# Altium schematic sheet 0110_AUDIO CODEC.SchDoc
size 848 x 558 mm
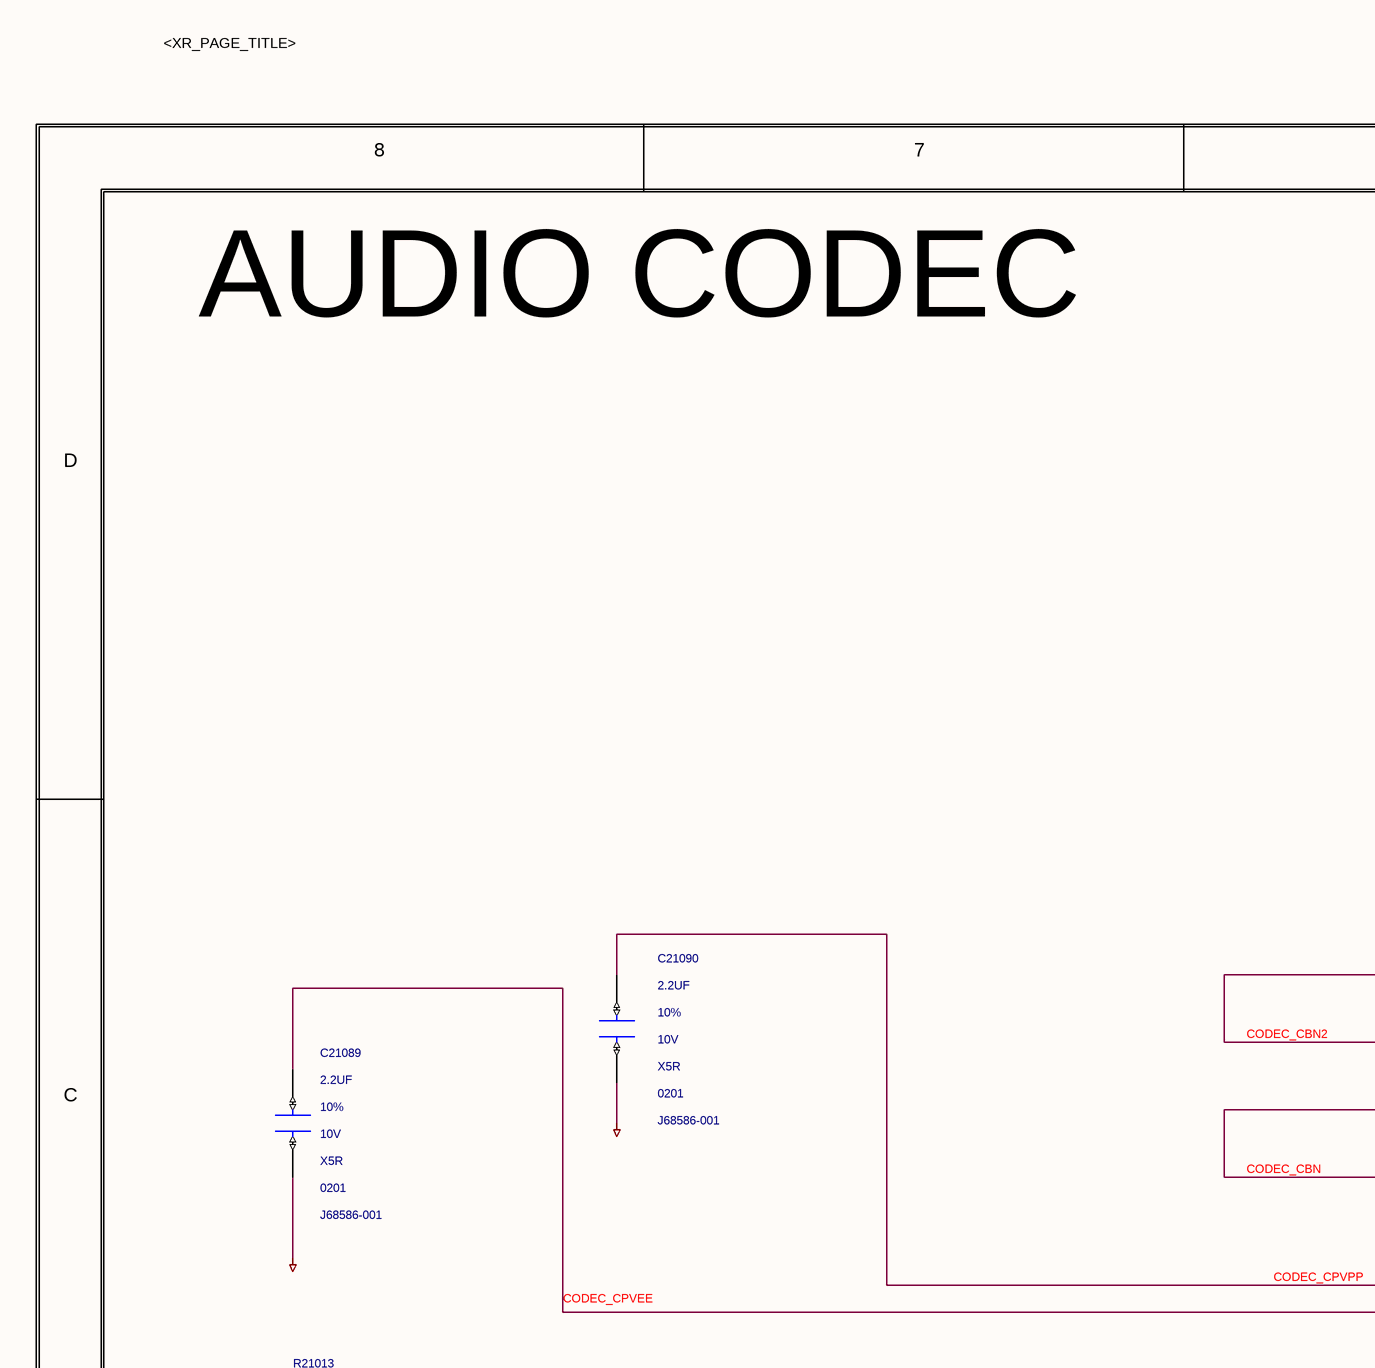
[diagram p0: 0110_AUDIO CODEC.SchDoc, top left]
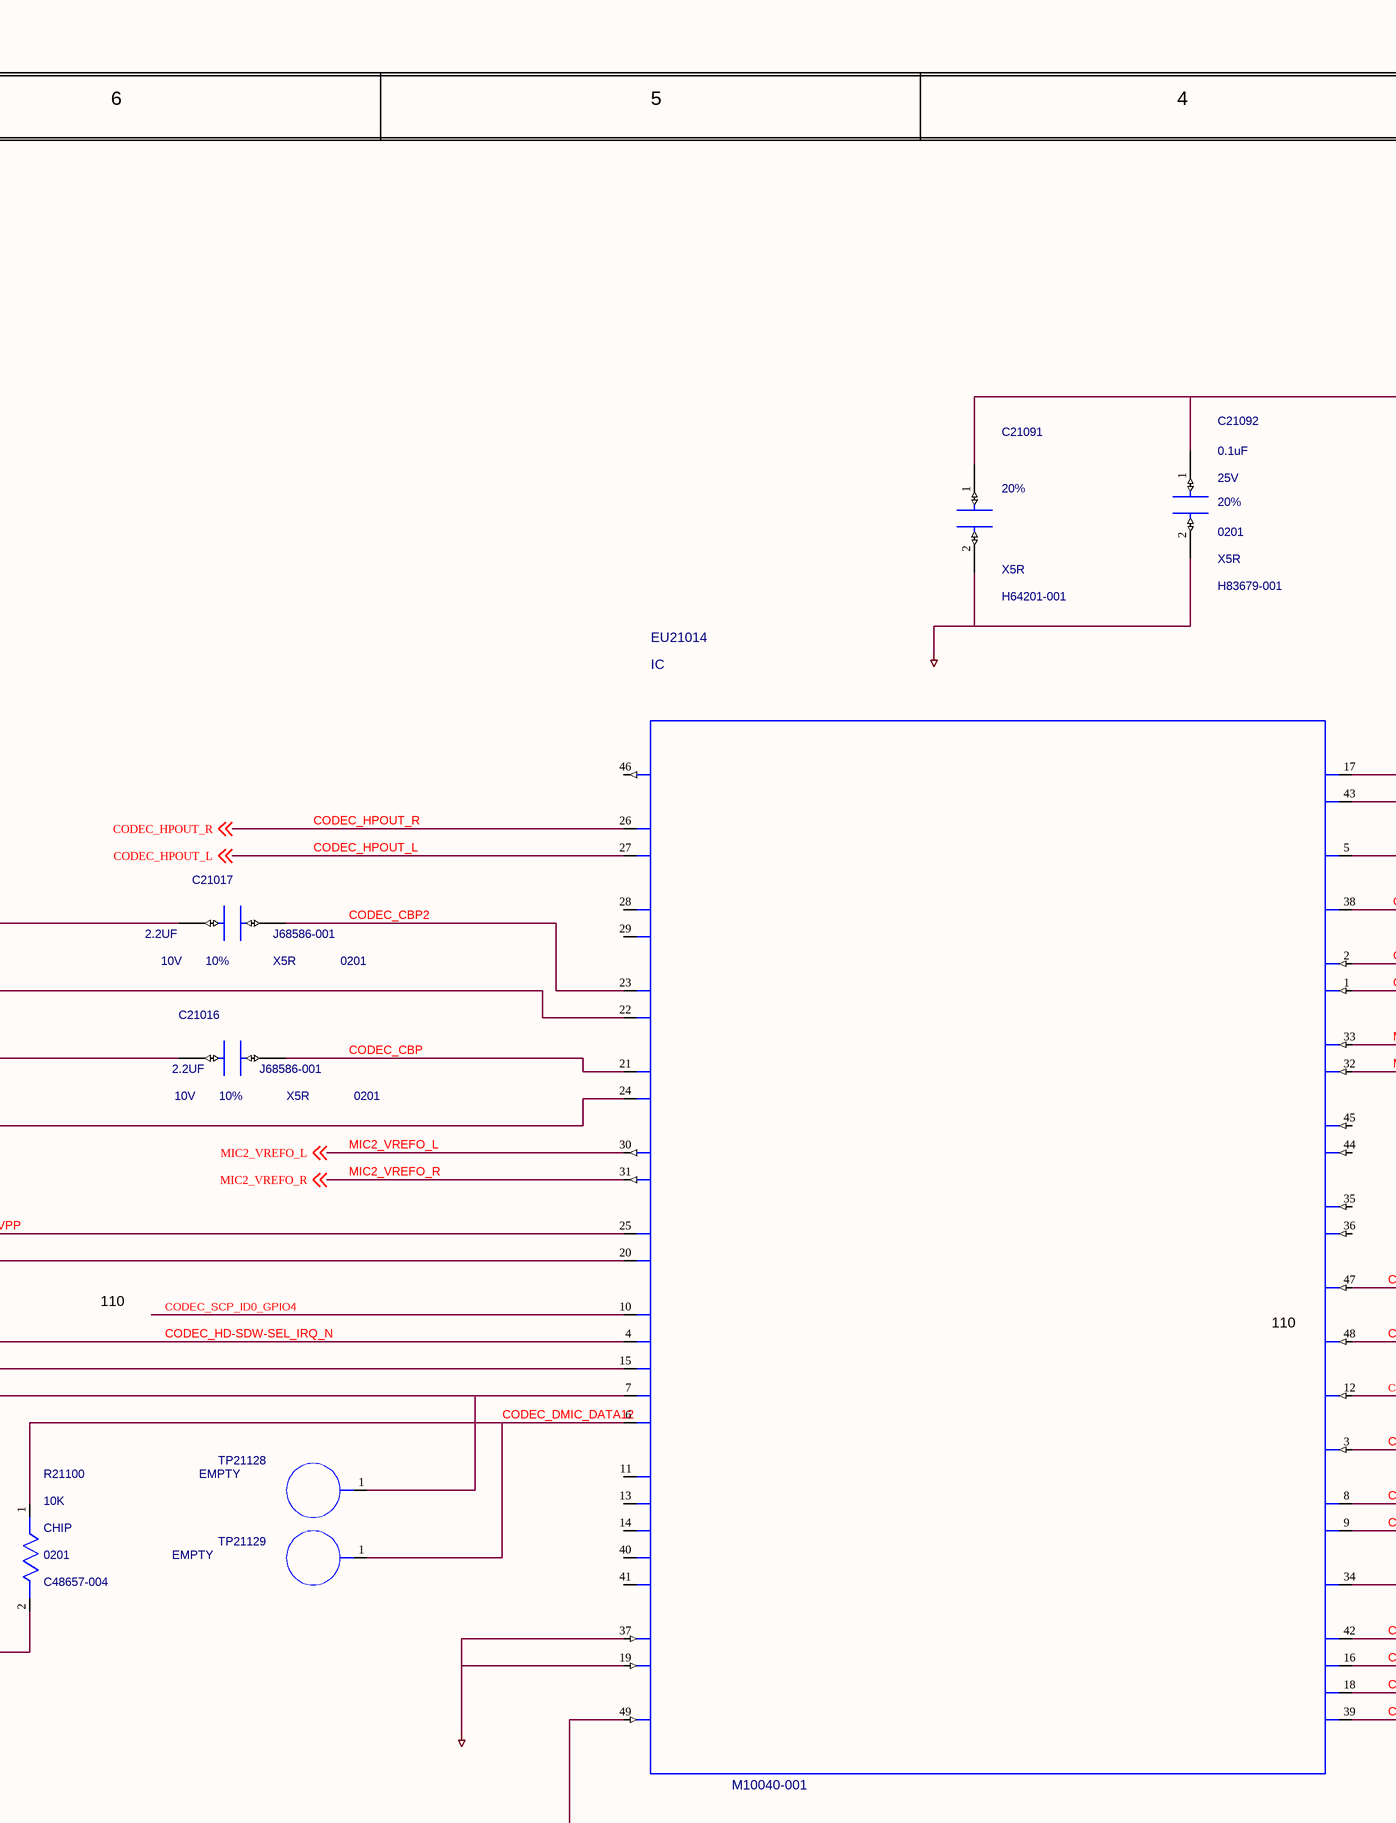
[diagram p1: 0110_AUDIO CODEC.SchDoc, top middle]
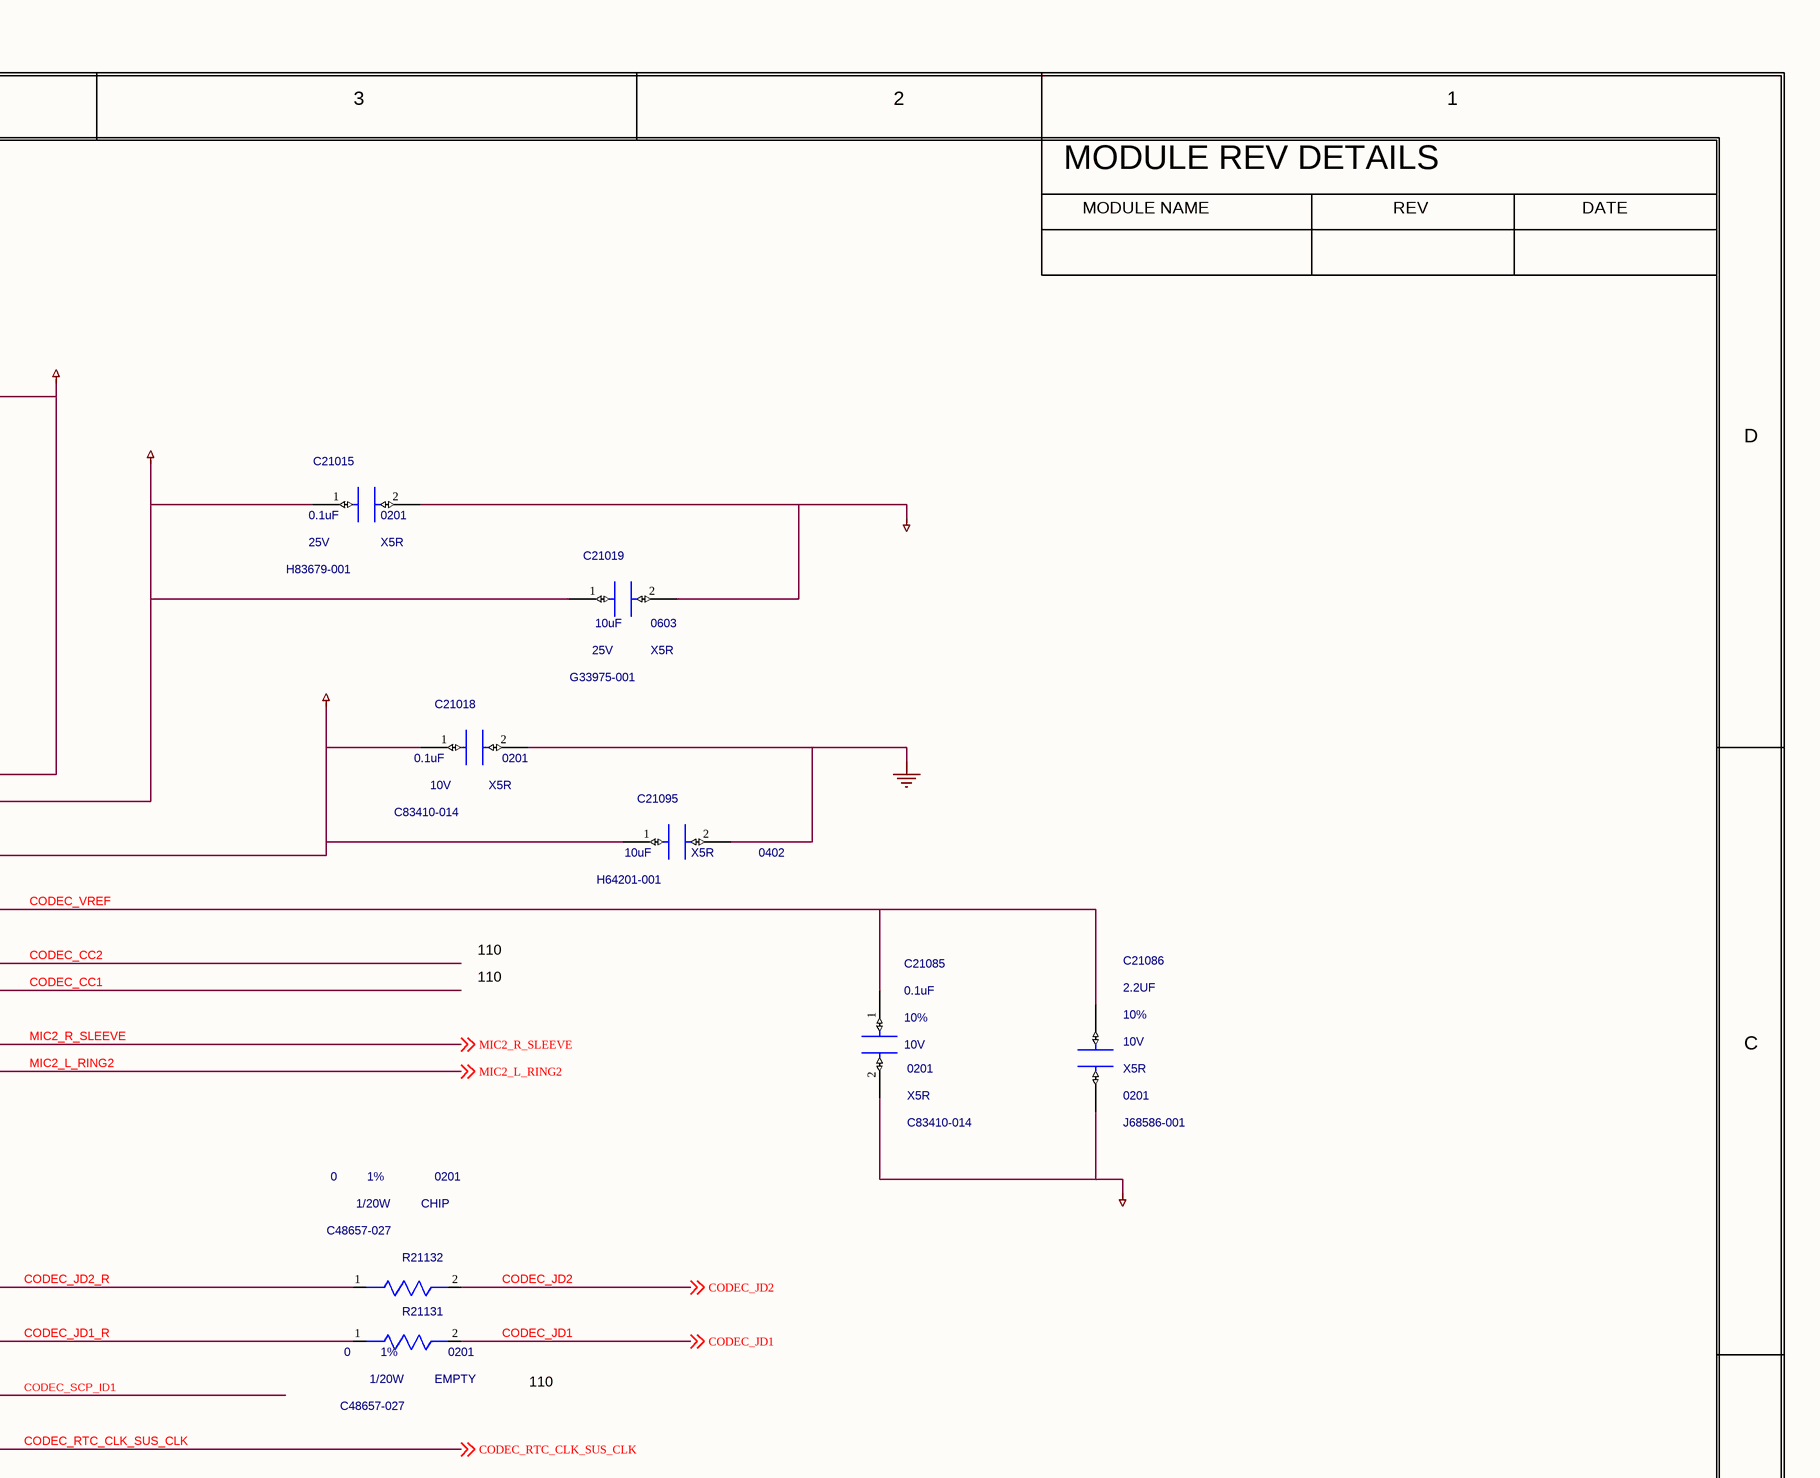
[diagram p2: 0110_AUDIO CODEC.SchDoc, top right]
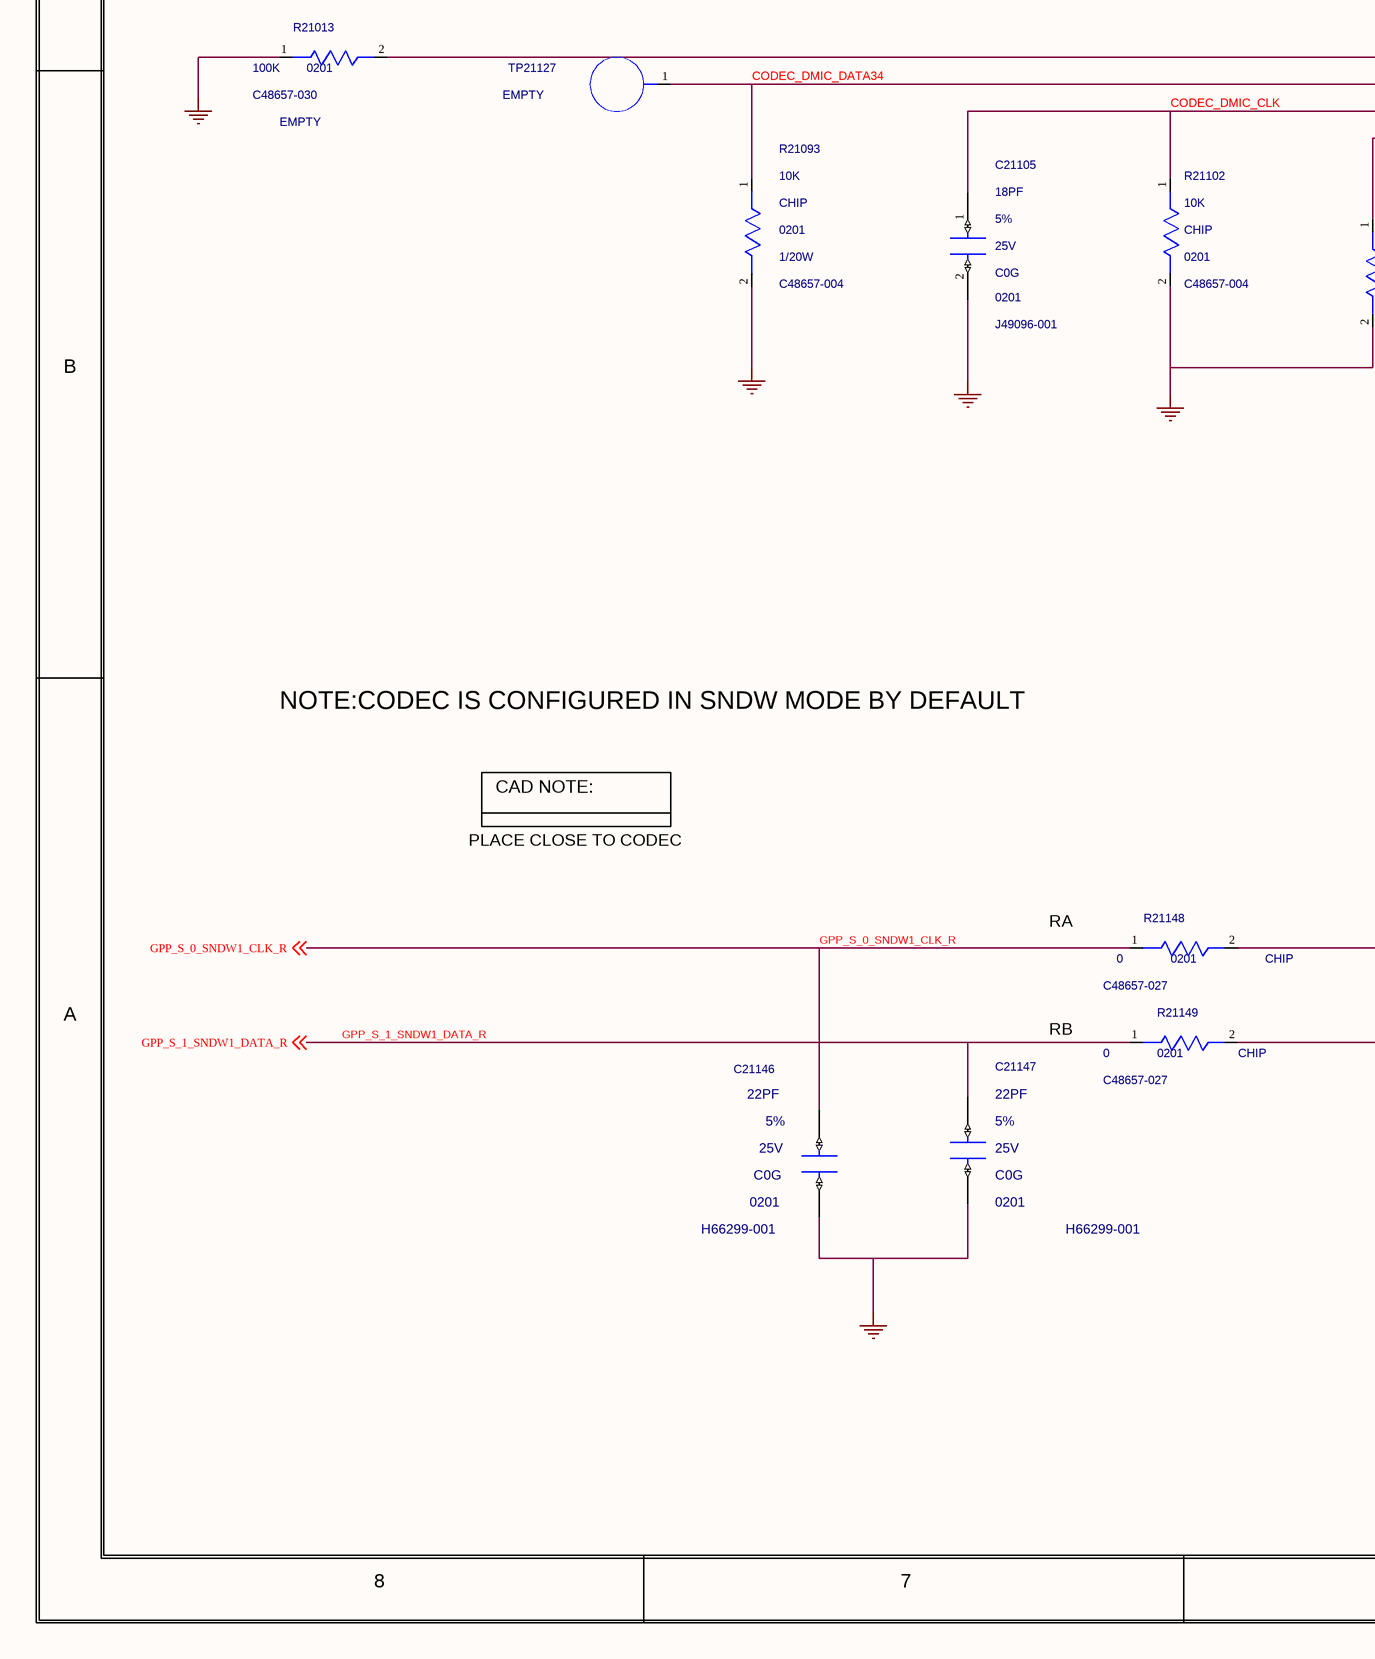
[diagram p3: 0110_AUDIO CODEC.SchDoc, bottom left]
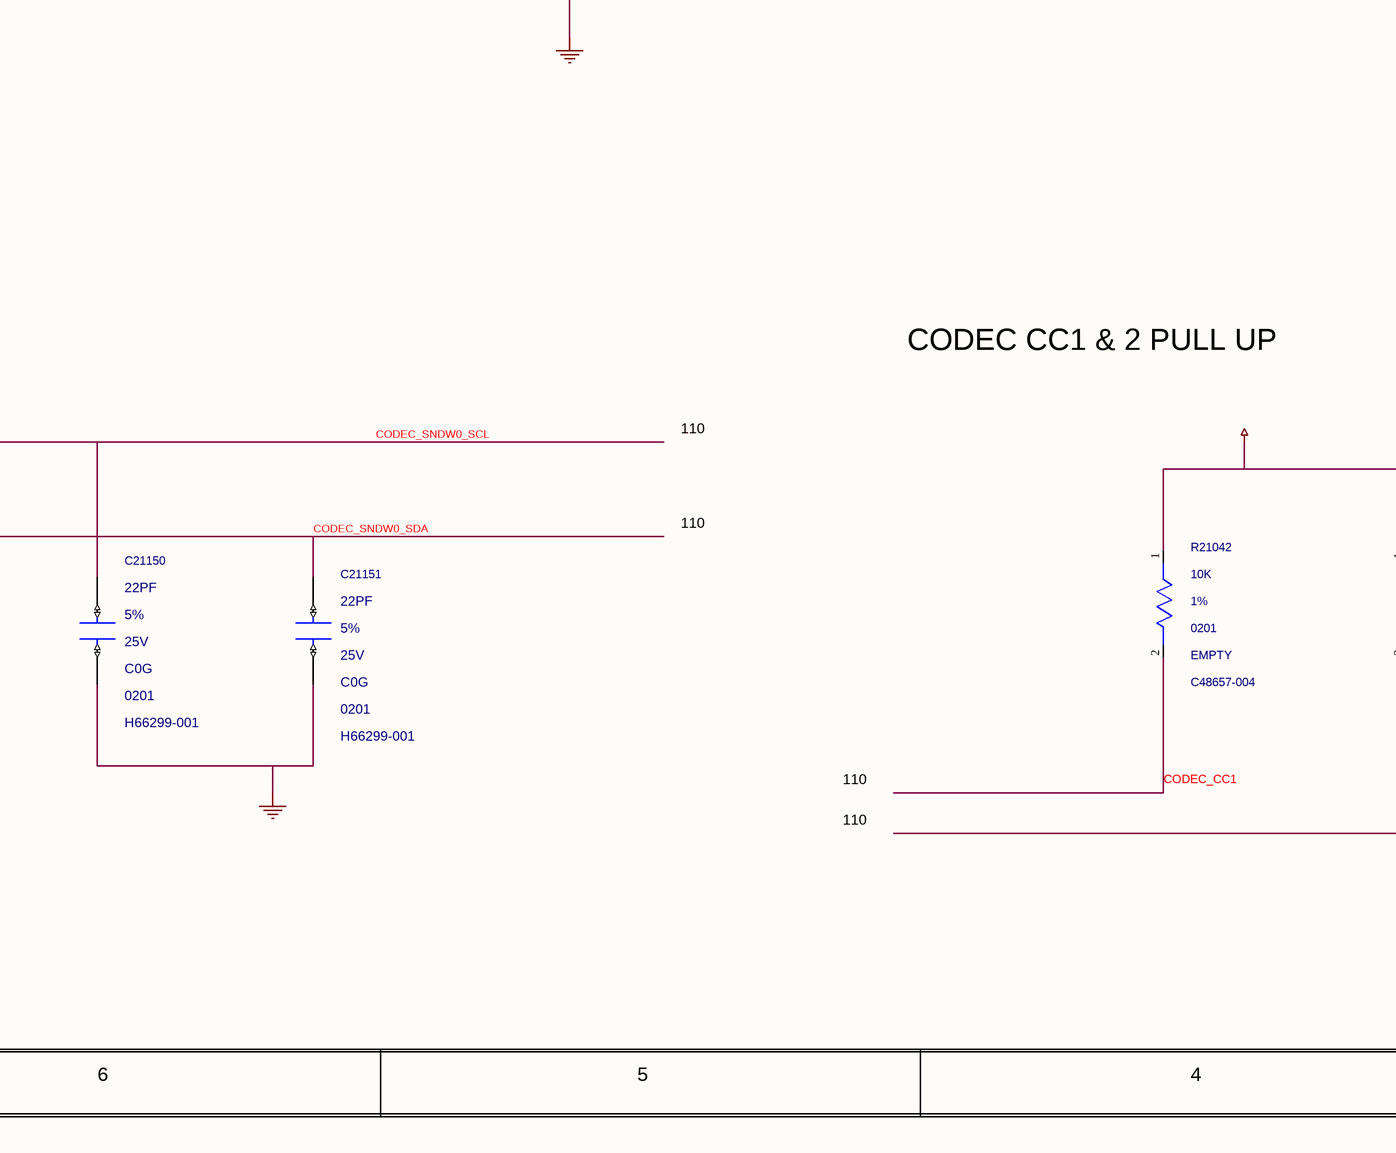
[diagram p4: 0110_AUDIO CODEC.SchDoc, bottom middle]
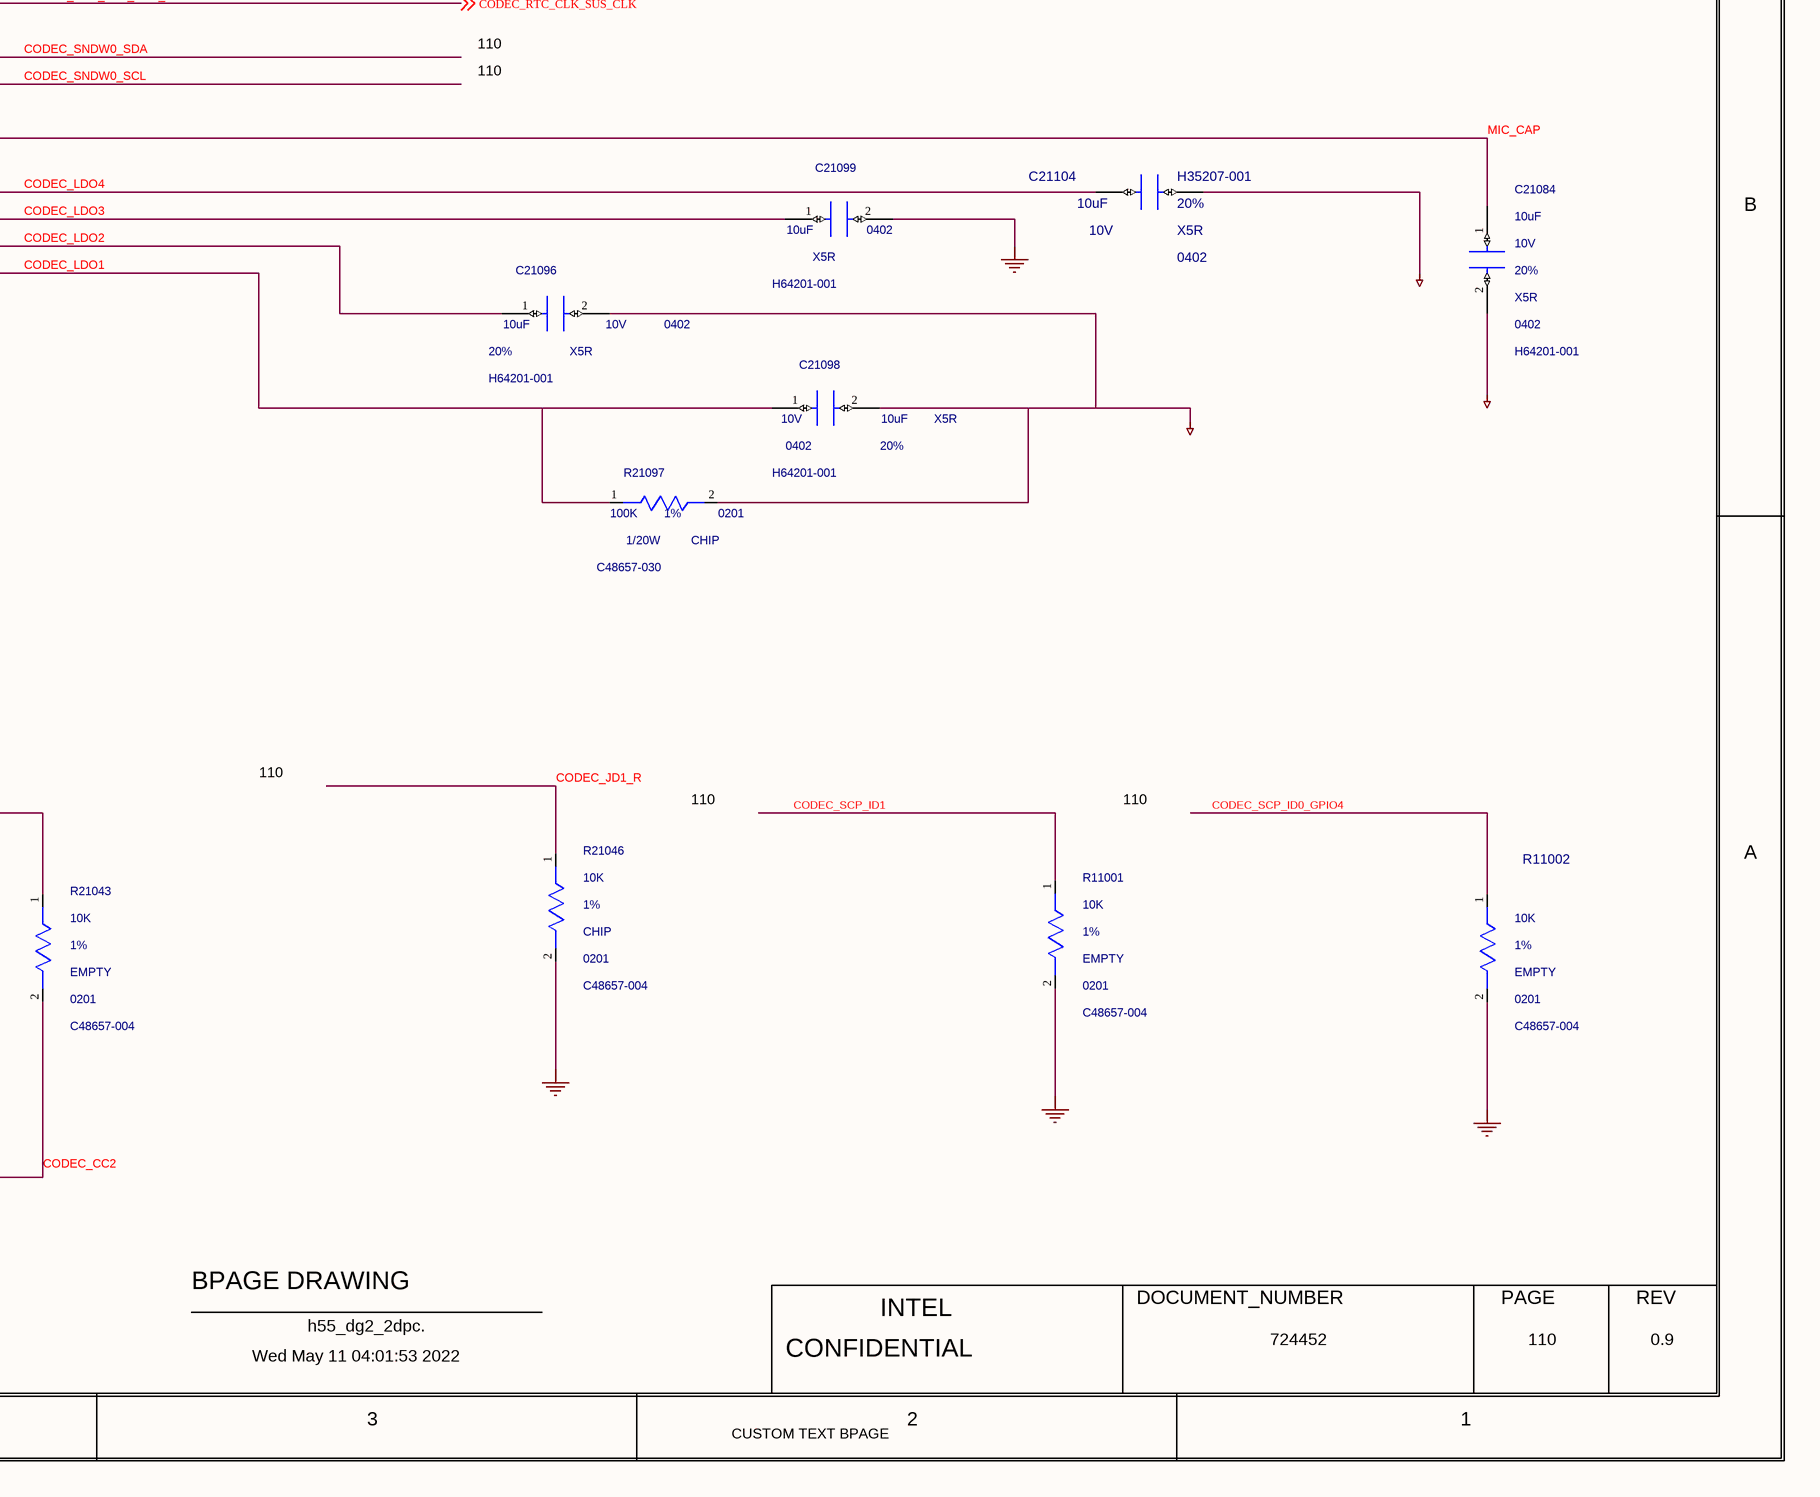
[diagram p5: 0110_AUDIO CODEC.SchDoc, bottom right]

## Parts
C21015  0.1uF  MATERIAL: X5R  PACK_TYPE: 0201  PART_NUMBER: H83679-001  VOLTAGE: 25V  [SMC0201MB]
C21016  2.2UF  MATERIAL: X5R  PACK_TYPE: 0201  PART_NUMBER: J68586-001  TOLERANCE: 10%  VOLTAGE: 10V  [CTK0_SM0201_690X390_MA]
C21017  2.2UF  MATERIAL: X5R  PACK_TYPE: 0201  PART_NUMBER: J68586-001  TOLERANCE: 10%  VOLTAGE: 10V  [CTK0_SM0201_690X390_MA]
C21018  0.1uF  MATERIAL: X5R  PACK_TYPE: 0201  PART_NUMBER: C83410-014  VOLTAGE: 10V  [SMC0201IA]
C21019  10uF  MATERIAL: X5R  PACK_TYPE: 0603  PART_NUMBER: G33975-001  VOLTAGE: 25V  [SMC0603IA]
C21084  10uF  MATERIAL: X5R  PACK_TYPE: 0402  PART_NUMBER: H64201-001  TOLERANCE: 20%  VOLTAGE: 10V  [SMC0402ID]
C21085  0.1uF  MATERIAL: X5R  PACK_TYPE: 0201  PART_NUMBER: C83410-014  TOLERANCE: 10%  VOLTAGE: 10V  [SMC0201IA]
C21086  2.2UF  MATERIAL: X5R  PACK_TYPE: 0201  PART_NUMBER: J68586-001  TOLERANCE: 10%  VOLTAGE: 10V  [CTK0_SM0201_690X390_MA]
C21089  2.2UF  MATERIAL: X5R  PACK_TYPE: 0201  PART_NUMBER: J68586-001  TOLERANCE: 10%  VOLTAGE: 10V  [CTK0_SM0201_690X390_MA]
C21090  2.2UF  MATERIAL: X5R  PACK_TYPE: 0201  PART_NUMBER: J68586-001  TOLERANCE: 10%  VOLTAGE: 10V  [CTK0_SM0201_690X390_MA]
C21091  MATERIAL: X5R  PART_NUMBER: H64201-001  TOLERANCE: 20%  [SMC0402ID]  (hidden comment: 10uF)
C21092  0.1uF  MATERIAL: X5R  PACK_TYPE: 0201  PART_NUMBER: H83679-001  TOLERANCE: 20%  VOLTAGE: 25V  [SMC0201MB]
C21095  10uF  MATERIAL: X5R  PACK_TYPE: 0402  PART_NUMBER: H64201-001  [SMC0402ID]
C21096  10uF  MATERIAL: X5R  PACK_TYPE: 0402  PART_NUMBER: H64201-001  TOLERANCE: 20%  VOLTAGE: 10V  [SMC0402ID]
C21098  10uF  MATERIAL: X5R  PACK_TYPE: 0402  PART_NUMBER: H64201-001  TOLERANCE: 20%  VOLTAGE: 10V  [SMC0402ID]
C21099  10uF  MATERIAL: X5R  PACK_TYPE: 0402  PART_NUMBER: H64201-001  [SMC0402ID]
C21104  10uF  MATERIAL: X5R  PACK_TYPE: 0402  PART_NUMBER: H35207-001  TOLERANCE: 20%  VOLTAGE: 10V  [CTK0_SM0402_1050X550_MA]
C21105  18PF  MATERIAL: C0G  PACK_TYPE: 0201  PART_NUMBER: J49096-001  TOLERANCE: 5%  VOLTAGE: 25V  [SMC0201IA]
C21146  22PF  MATERIAL: C0G  PACK_TYPE: 0201  PART_NUMBER: H66299-001  TOLERANCE: 5%  VOLTAGE: 25V  [CTK0_SM0201_630X330_MA]
C21147  22PF  MATERIAL: C0G  PACK_TYPE: 0201  PART_NUMBER: H66299-001  TOLERANCE: 5%  VOLTAGE: 25V  [CTK0_SM0201_630X330_MA]
C21150  22PF  MATERIAL: C0G  PACK_TYPE: 0201  PART_NUMBER: H66299-001  TOLERANCE: 5%  VOLTAGE: 25V  [CTK0_SM0201_630X330_MA]
C21151  22PF  MATERIAL: C0G  PACK_TYPE: 0201  PART_NUMBER: H66299-001  TOLERANCE: 5%  VOLTAGE: 25V  [CTK0_SM0201_630X330_MA]
EU21014  MATERIAL: IC  PART_NUMBER: M10040-001  [CTK1_LCC48_S6000_400_DFS4400_MA]  (hidden comment: C_ALC711)
R11001  10K  MATERIAL: EMPTY  PACK_TYPE: 0201  PART_NUMBER: C48657-004  TOLERANCE: 1%  [SMR0201IA]
R11002  10K  MATERIAL: EMPTY  PACK_TYPE: 0201  PART_NUMBER: C48657-004  TOLERANCE: 1%  [SMR0201IA]
R21013  100K  MATERIAL: EMPTY  PACK_TYPE: 0201  PART_NUMBER: C48657-030  [SMR0201MC]
R21042  10K  MATERIAL: EMPTY  PACK_TYPE: 0201  PART_NUMBER: C48657-004  TOLERANCE: 1%  [SMR0201IA]
R21043  10K  MATERIAL: EMPTY  PACK_TYPE: 0201  PART_NUMBER: C48657-004  TOLERANCE: 1%  [SMR0201IA]
R21046  10K  MATERIAL: CHIP  PACK_TYPE: 0201  PART_NUMBER: C48657-004  TOLERANCE: 1%  [SMR0201IA]
R21093  10K  MATERIAL: CHIP  PACK_TYPE: 0201  PART_NUMBER: C48657-004  WATTAGE: 1/20W  [SMR0201IA]
R21097  100K  MATERIAL: CHIP  PACK_TYPE: 0201  PART_NUMBER: C48657-030  TOLERANCE: 1%  WATTAGE: 1/20W  [SMR0201MC]
R21100  10K  MATERIAL: CHIP  PACK_TYPE: 0201  PART_NUMBER: C48657-004  [SMR0201IA]
R21102  10K  MATERIAL: CHIP  PACK_TYPE: 0201  PART_NUMBER: C48657-004  [SMR0201IA]
R21131  0  MATERIAL: EMPTY  PACK_TYPE: 0201  PART_NUMBER: C48657-027  TOLERANCE: 1%  WATTAGE: 1/20W  [SMR0201IA]
R21132  0  MATERIAL: CHIP  PACK_TYPE: 0201  PART_NUMBER: C48657-027  TOLERANCE: 1%  WATTAGE: 1/20W  [SMR0201IA]
R21148  0  MATERIAL: CHIP  PACK_TYPE: 0201  PART_NUMBER: C48657-027  [SMR0201IA]
R21149  0  MATERIAL: CHIP  PACK_TYPE: 0201  PART_NUMBER: C48657-027  [SMR0201IA]
TP21127  MATERIAL: EMPTY  [TPS16]  (hidden comment: TP)
TP21128  MATERIAL: EMPTY  [TPS16]  (hidden comment: TP)
TP21129  MATERIAL: EMPTY  [TPS16]  (hidden comment: TP)

## Nets
+V1P8A_AUDIO: C21018.1(A) C21095.1(A) EU21014.5(DVDD)
+V1P8A_AUDIO_FIL: C21091.1(A) C21092.1(A) EU21014.17(AVDD2)
+V5A_AUDIO_FIL: C21015.1(A) C21019.1(A) EU21014.43(AVDD1) R21042.1(A) R21043.1(A)
AUDIO_AGND: C21015.2(B) C21019.2(B) C21084.2(B) C21085.2(B) C21086.2(B) C21089.2(B) C21090.2(B) C21091.2(B) C21092.2(B) C21096.2(B) C21098.2(B) C21104.2(B) EU21014.19(AVSS2) EU21014.37(AVSS1) R21097.2(B)
GND: C21018.2(B) C21095.2(B) C21099.2(B) C21105.2(B) C21146.2(B) C21147.2(B) C21150.2(B) C21151.2(B) EU21014.49(DGND_TPD) R11001.2(B) R11002.2(B) R21013.1(A) R21046.2(B) R21093.2(B) R21100.2(B) R21102.2(B)
CODEC_CBN: C21016.1(A) EU21014.24(CBN)
CODEC_CBN2: C21017.1(A) EU21014.22(CBN2)
CODEC_CBP: C21016.2(B) EU21014.21(CBP)
CODEC_CBP2: C21017.2(B) EU21014.23(CBP2)
CODEC_CC1: EU21014.1(CC1) R21042.2(B)
CODEC_CC2: EU21014.2(CC2) R21043.2(B)
CODEC_CPVEE: C21089.1(A) EU21014.20(CPVEE)
CODEC_CPVPP: C21090.1(A) EU21014.25(CPVPP)
CODEC_DMIC_CLK: C21105.1(A) EU21014.7(GPIO1_DMIC_CLK) R21102.1(A) TP21128.1(TP)
CODEC_DMIC_DATA12: EU21014.6(GPIO0_DMIC_DATA12) R21100.1(A) TP21129.1(TP)
CODEC_DMIC_DATA34: EU21014.15(GPIO2_DMIC_DATA34) R21093.1(A) TP21127.1(TP)
CODEC_HD-SDW-SEL_IRQ_N: EU21014.4(GPIO3) R21013.2(B)
CODEC_HPOUT_L: EU21014.27(HPOUT_L_PORT_I_L) ; off-sheet CODEC_HPOUT_L
CODEC_HPOUT_R: EU21014.26(HPOUT_R_PORT_I_R) ; off-sheet CODEC_HPOUT_R
CODEC_JD1: R21131.2(B) ; off-sheet CODEC_JD1
CODEC_JD1_R: EU21014.48(AGPI) R21046.1(A) R21131.1(A)
CODEC_JD2: R21132.2(B) ; off-sheet CODEC_JD2
CODEC_JD2_R: EU21014.47(LINE2_JD) R21132.1(A)
CODEC_LDO1: C21098.1(A) EU21014.39(LDO1_CAP) R21097.1(A)
CODEC_LDO2: C21096.1(A) EU21014.18(LDO2_CAP)
CODEC_LDO3: C21099.1(A) EU21014.16(LDO3_CAP)
CODEC_LDO4: C21104.1(A) EU21014.42(LDO4_CAP)
CODEC_RTC_CLK_SUS_CLK: EU21014.3(RTCLK) ; off-sheet CODEC_RTC_CLK_SUS_CLK
CODEC_SCP_ID0_GPIO4: EU21014.10(SCP_ID0_GPIO4) R11002.1(A)
CODEC_SCP_ID1: EU21014.12(SCP_ID1) R11001.1(A)
CODEC_SNDW0_SCL: C21150.1(A) EU21014.9(SDW_CLK) R21148.2(B)
CODEC_SNDW0_SDA: C21151.1(A) EU21014.8(SDW_DAT) R21149.2(B)
CODEC_VREF: C21085.1(A) C21086.1(A) EU21014.38(VREF)
GPP_S_0_SNDW1_CLK_R: C21146.1(A) R21148.1(A) ; off-sheet GPP_S_0_SNDW1_CLK_R
GPP_S_1_SNDW1_DATA_R: C21147.1(A) R21149.1(A) ; off-sheet GPP_S_1_SNDW1_DATA_R
MIC2_L_RING2: EU21014.32(RING2_MIC2_L_PORT_F_L) ; off-sheet MIC2_L_RING2
MIC2_R_SLEEVE: EU21014.33(SLEEVE_MIC2_R_PORT_F_R) ; off-sheet MIC2_R_SLEEVE
MIC2_VREFO_L: EU21014.30(MIC2_VREFO_L) ; off-sheet MIC2_VREFO_L
MIC2_VREFO_R: EU21014.31(MIC2_VREFO_R) ; off-sheet MIC2_VREFO_R
MIC_CAP: C21084.1(A) EU21014.34(MIC2_CAP)

Not connected (* = marked no-connect by the designer): EU21014 11(NC_1) 13(NC_2) 14(NC_3) 28(USB_DP_IN) 29(USB_DN_IN) 35(LINE1_R_PORT_C_R) 36(LINE1_L_PORT_C_L) 40(NC_4) 41(NC_5) 44(LINE2_L_PORT_E_L) 45(LINE2_R_PORT_E_R) 46(LINE2_VREFO)

## Notes on the sheet
- <XR_PAGE_TITLE>
- 8
- 7
- 6
- 5
- 4
- 3
- 2
- 1
- MODULE REV DETAILS
- MODULE NAME
- REV
- DATE
- AUDIO CODEC
- D
- 110
- C
- (near EU21014) 110
- B
- NOTE:CODEC IS CONFIGURED IN SNDW MODE BY DEFAULT
- CAD NOTE:
- PLACE CLOSE TO CODEC
- CODEC CC1 & 2 PULL UP
- RA
- A
- RB
- BPAGE DRAWING
- INTEL
- DOCUMENT_NUMBER
- PAGE
- Wed May 11 04:01:53 2022
- h55_dg2_2dpc.
- CONFIDENTIAL
- 724452
- 0.9
- CUSTOM TEXT BPAGE

## Library data of the parts
C21015 = CAP#1: CHIPS_PART_NAME: CAP; CDS_PHYS_PART_NAME: CAP_0201-H83679-001,X5R,0.1UF,25V,20%,LPDB,GENERIC; TOLERANCE: 20%; OriginalSymbolOrigin: (-25,50); XY: (3325,2150); VER: 2; SUB_ROOM: CODEC_DECOUPLING; ROT: 0; PHYS_PAGE: 110; LOCATION: C21015; IP: GENERIC; FP_TECH: LPDB; DRAWING: @RVP1_ADL_SB_ADP_S_DDR5_SODIMM_2DPC_LIB.H55_DG2_2DPC(SCH_1):PAGE481; CDS_LIB: discrete; PCB Footprint: SMC0201MB; SEC_TYPE: 0201; CDS_PART_NAME: CAP_0201-H83679-001,X5R,0.1UF,25V,20%,LPDB,GENERIC; CDS_LOCATION: C21015
C21016 = C_CAP#1: CHIPS_PART_NAME: C_CAP; CDS_PHYS_PART_NAME: C_CAP_0201-J68586-001,X5R,2.2UF,10V,10%,TK0,GENERIC; CDS_LMAN_SYM_OUTLINE: -50,50,50,-50; FP_TECH: TK0; IP: GENERIC; ROOM: NONE; OriginalSymbolOrigin: (-25,50); XY: (550,1125); VER: 2; SUB_ROOM: CODEC_DECOUPLING; ROT: 0; PHYS_PAGE: 110; LOCATION: C21016; DRAWING: @RVP1_ADL_SB_ADP_S_DDR5_SODIMM_2DPC_LIB.H55_DG2_2DPC(SCH_1):PAGE481; CDS_LIB: c_discrete; VARIANT: ?; PCB Footprint: CTK0_SM0201_690X390_MA; SEC_TYPE: 0201; CDS_PART_NAME: C_CAP_0201-J68586-001,X5R,2.2UF,10V,10%,TK0,GENERIC; CDS_LOCATION: C21016
C21017 = C_CAP#1: CHIPS_PART_NAME: C_CAP; CDS_PHYS_PART_NAME: C_CAP_0201-J68586-001,X5R,2.2UF,10V,10%,TK0,GENERIC; CDS_LMAN_SYM_OUTLINE: -50,50,50,-50; FP_TECH: TK0; IP: GENERIC; ROOM: NONE; OriginalSymbolOrigin: (-25,50); XY: (550,1375); VER: 2; SUB_ROOM: CODEC_DECOUPLING; ROT: 0; PHYS_PAGE: 110; LOCATION: C21017; DRAWING: @RVP1_ADL_SB_ADP_S_DDR5_SODIMM_2DPC_LIB.H55_DG2_2DPC(SCH_1):PAGE481; CDS_LIB: c_discrete; VARIANT: ?; PCB Footprint: CTK0_SM0201_690X390_MA; SEC_TYPE: 0201; CDS_PART_NAME: C_CAP_0201-J68586-001,X5R,2.2UF,10V,10%,TK0,GENERIC; CDS_LOCATION: C21017
C21018 = CAP#1: CHIPS_PART_NAME: CAP; CDS_PHYS_PART_NAME: CAP_0201-C83410-014,X5R,0.1UF,10V,10%,LPDB,GENERIC; TOLERANCE: 10%; OriginalSymbolOrigin: (-25,50); XY: (3525,1700); VER: 2; SUB_ROOM: CODEC_DECOUPLING; ROT: 0; PHYS_PAGE: 110; LOCATION: C21018; DRAWING: @RVP1_ADL_SB_ADP_S_DDR5_SODIMM_2DPC_LIB.H55_DG2_2DPC(SCH_1):PAGE481; CDS_LIB: discrete; PCB Footprint: SMC0201IA; SEC_TYPE: 0201; CDS_PART_NAME: CAP_0201-C83410-014,X5R,0.1UF,10V,10%,LPDB,GENERIC; CDS_LOCATION: C21018
C21019 = CAP#1: CHIPS_PART_NAME: CAP; CDS_PHYS_PART_NAME: CAP_0603-G33975-001,X5R,10UF,25V,20%,LPDB,GENERIC; TOLERANCE: 20%; OriginalSymbolOrigin: (-25,50); XY: (3800,1975); VER: 2; SUB_ROOM: CODEC_DECOUPLING; ROT: 0; PHYS_PAGE: 110; LOCATION: C21019; DRAWING: @RVP1_ADL_SB_ADP_S_DDR5_SODIMM_2DPC_LIB.H55_DG2_2DPC(SCH_1):PAGE481; CDS_LIB: discrete; PCB Footprint: SMC0603IA; SEC_TYPE: 0603; CDS_PART_NAME: CAP_0603-G33975-001,X5R,10UF,25V,20%,LPDB,GENERIC; CDS_LOCATION: C21019
C21084 = CAP: CDS_PHYS_PART_NAME: CAP_0402-H64201-001,X5R,10UF,10V,20%,LPDB,GENERIC; OriginalSymbolOrigin: (-50,25); XY: (5400,-75); VER: 1; SUB_ROOM: CODEC_DECOUPLING; ROT: 0; PHYS_PAGE: 110; LOCATION: C21084; IP: GENERIC; FP_TECH: LPDB; DRAWING: @RVP1_ADL_SB_ADP_S_DDR5_SODIMM_2DPC_LIB.H55_DG2_2DPC(SCH_1):PAGE481; CDS_LIB: discrete; PCB Footprint: SMC0402ID; SEC_TYPE: 0402; CHIPS_PART_NAME: CAP; CDS_PART_NAME: CAP_0402-H64201-001,X5R,10UF,10V,20%,LPDB,GENERIC; CDS_LOCATION: C21084
C21085 = CAP: CDS_PHYS_PART_NAME: CAP_0201-C83410-014,X5R,0.1UF,10V,10%,LPDB,GENERIC; OriginalSymbolOrigin: (-50,25); XY: (4275,1150); VER: 1; SUB_ROOM: CODEC_DECOUPLING; ROT: 0; PHYS_PAGE: 110; LOCATION: C21085; DRAWING: @RVP1_ADL_SB_ADP_S_DDR5_SODIMM_2DPC_LIB.H55_DG2_2DPC(SCH_1):PAGE481; CDS_LIB: discrete; PCB Footprint: SMC0201IA; CHIPS_PART_NAME: CAP; CDS_PART_NAME: CAP_0201-C83410-014,X5R,0.1UF,10V,10%,LPDB,GENERIC; CDS_LOCATION: C21085
C21086 = C_CAP: CDS_PHYS_PART_NAME: C_CAP_0201-J68586-001,X5R,2.2UF,10V,10%,TK0,GENERIC; CDS_LMAN_SYM_OUTLINE: -50,50,50,-50; FP_TECH: TK0; IP: GENERIC; ROOM: NONE; OriginalSymbolOrigin: (-50,25); XY: (4675,1125); VER: 1; SUB_ROOM: CODEC_DECOUPLING; ROT: 0; PHYS_PAGE: 110; LOCATION: C21086; DRAWING: @RVP1_ADL_SB_ADP_S_DDR5_SODIMM_2DPC_LIB.H55_DG2_2DPC(SCH_1):PAGE481; CDS_LIB: c_discrete; VARIANT: ?; PCB Footprint: CTK0_SM0201_690X390_MA; CHIPS_PART_NAME: C_CAP; CDS_PART_NAME: C_CAP_0201-J68586-001,X5R,2.2UF,10V,10%,TK0,GENERIC; CDS_LOCATION: C21086
C21089 = C_CAP: CDS_PHYS_PART_NAME: C_CAP_0201-J68586-001,X5R,2.2UF,10V,10%,TK0,GENERIC; CDS_LMAN_SYM_OUTLINE: -50,50,50,-50; FP_TECH: TK0; IP: GENERIC; ROOM: NONE; OriginalSymbolOrigin: (-50,25); XY: (-1825,1100); VER: 1; SUB_ROOM: CODEC_DECOUPLING; ROT: 0; PHYS_PAGE: 110; LOCATION: C21089; DRAWING: @RVP1_ADL_SB_ADP_S_DDR5_SODIMM_2DPC_LIB.H55_DG2_2DPC(SCH_1):PAGE481; CDS_LIB: c_discrete; VARIANT: ?; PCB Footprint: CTK0_SM0201_690X390_MA; CHIPS_PART_NAME: C_CAP; CDS_PART_NAME: C_CAP_0201-J68586-001,X5R,2.2UF,10V,10%,TK0,GENERIC; CDS_LOCATION: C21089
C21090 = C_CAP: CDS_PHYS_PART_NAME: C_CAP_0201-J68586-001,X5R,2.2UF,10V,10%,TK0,GENERIC; CDS_LMAN_SYM_OUTLINE: -50,50,50,-50; FP_TECH: TK0; IP: GENERIC; ROOM: NONE; OriginalSymbolOrigin: (-50,25); XY: (-1225,1275); VER: 1; SUB_ROOM: CODEC_DECOUPLING; ROT: 0; PHYS_PAGE: 110; LOCATION: C21090; DRAWING: @RVP1_ADL_SB_ADP_S_DDR5_SODIMM_2DPC_LIB.H55_DG2_2DPC(SCH_1):PAGE481; CDS_LIB: c_discrete; VARIANT: ?; PCB Footprint: CTK0_SM0201_690X390_MA; CHIPS_PART_NAME: C_CAP; CDS_PART_NAME: C_CAP_0201-J68586-001,X5R,2.2UF,10V,10%,TK0,GENERIC; CDS_LOCATION: C21090
C21091 = CAP: CDS_PHYS_PART_NAME: CAP_0402-H64201-001,X5R,10UF,10V,20%,LPDB,GENERIC; PACK_TYPE: 0402; VOLTAGE: 10V; OriginalSymbolOrigin: (-50,25); XY: (1925,2125); VER: 1; SUB_ROOM: CODEC_DECOUPLING; ROT: 2; PHYS_PAGE: 110; LOCATION: C21091; IP: GENERIC; FP_TECH: LPDB; DRAWING: @RVP1_ADL_SB_ADP_S_DDR5_SODIMM_2DPC_LIB.H55_DG2_2DPC(SCH_1):PAGE481; CDS_LIB: discrete; PCB Footprint: SMC0402ID; SEC_TYPE: 0402; CHIPS_PART_NAME: CAP; CDS_PART_NAME: CAP_0402-H64201-001,X5R,10UF,10V,20%,LPDB,GENERIC; CDS_LOCATION: C21091
C21092 = CAP: CDS_PHYS_PART_NAME: CAP_0201-H83679-001,X5R,0.1UF,25V,20%,LPDB,GENERIC; OriginalSymbolOrigin: (-50,25); XY: (2325,2150); VER: 1; SUB_ROOM: CODEC_DECOUPLING; ROT: 2; PHYS_PAGE: 110; LOCATION: C21092; IP: GENERIC; FP_TECH: LPDB; DRAWING: @RVP1_ADL_SB_ADP_S_DDR5_SODIMM_2DPC_LIB.H55_DG2_2DPC(SCH_1):PAGE481; CDS_LIB: discrete; PCB Footprint: SMC0201MB; SEC_TYPE: 0201; CHIPS_PART_NAME: CAP; CDS_PART_NAME: CAP_0201-H83679-001,X5R,0.1UF,25V,20%,LPDB,GENERIC; CDS_LOCATION: C21092
C21095 = CAP#1: CHIPS_PART_NAME: CAP; CDS_PHYS_PART_NAME: CAP_0402-H64201-001,X5R,10UF,10V,20%,LPDB,GENERIC; TOLERANCE: 20%; VOLTAGE: 10V; OriginalSymbolOrigin: (-25,50); XY: (3900,1525); VER: 2; SUB_ROOM: CODEC_DECOUPLING; ROT: 0; PHYS_PAGE: 110; LOCATION: C21095; IP: GENERIC; FP_TECH: LPDB; DRAWING: @RVP1_ADL_SB_ADP_S_DDR5_SODIMM_2DPC_LIB.H55_DG2_2DPC(SCH_1):PAGE481; CDS_LIB: discrete; PCB Footprint: SMC0402ID; CDS_PART_NAME: CAP_0402-H64201-001,X5R,10UF,10V,20%,LPDB,GENERIC; CDS_LOCATION: C21095
C21096 = CAP#1: CHIPS_PART_NAME: CAP; CDS_PHYS_PART_NAME: CAP_0402-H64201-001,X5R,10UF,10V,20%,LPDB,GENERIC; OriginalSymbolOrigin: (-25,50); XY: (3675,-175); VER: 2; SUB_ROOM: CODEC_DECOUPLING; ROT: 0; PHYS_PAGE: 110; LOCATION: C21096; IP: GENERIC; FP_TECH: LPDB; DRAWING: @RVP1_ADL_SB_ADP_S_DDR5_SODIMM_2DPC_LIB.H55_DG2_2DPC(SCH_1):PAGE481; CDS_LIB: discrete; PCB Footprint: SMC0402ID; CDS_PART_NAME: CAP_0402-H64201-001,X5R,10UF,10V,20%,LPDB,GENERIC; CDS_LOCATION: C21096
C21098 = CAP#1: CHIPS_PART_NAME: CAP; CDS_PHYS_PART_NAME: CAP_0402-H64201-001,X5R,10UF,10V,20%,LPDB,GENERIC; OriginalSymbolOrigin: (-25,50); XY: (4175,-350); VER: 2; SUB_ROOM: CODEC_DECOUPLING; ROT: 0; PHYS_PAGE: 110; LOCATION: C21098; IP: GENERIC; FP_TECH: LPDB; DRAWING: @RVP1_ADL_SB_ADP_S_DDR5_SODIMM_2DPC_LIB.H55_DG2_2DPC(SCH_1):PAGE481; CDS_LIB: discrete; PCB Footprint: SMC0402ID; CDS_PART_NAME: CAP_0402-H64201-001,X5R,10UF,10V,20%,LPDB,GENERIC; CDS_LOCATION: C21098
C21099 = CAP#1: CHIPS_PART_NAME: CAP; CDS_PHYS_PART_NAME: CAP_0402-H64201-001,X5R,10UF,10V,20%,LPDB,GENERIC; TOLERANCE: 20%; VOLTAGE: 10V; OriginalSymbolOrigin: (-25,50); XY: (4200,0); VER: 2; SUB_ROOM: CODEC_DECOUPLING; ROT: 0; PHYS_PAGE: 110; LOCATION: C21099; IP: GENERIC; FP_TECH: LPDB; DRAWING: @RVP1_ADL_SB_ADP_S_DDR5_SODIMM_2DPC_LIB.H55_DG2_2DPC(SCH_1):PAGE481; CDS_LIB: discrete; PCB Footprint: SMC0402ID; CDS_PART_NAME: CAP_0402-H64201-001,X5R,10UF,10V,20%,LPDB,GENERIC; CDS_LOCATION: C21099
C21104 = C_CAP#1: CHIPS_PART_NAME: C_CAP; CDS_PHYS_PART_NAME: C_CAP_0402-H35207-001,X5R,10UF,10V,20%,TK0,GENERIC; CDS_LMAN_SYM_OUTLINE: -50,50,50,-50; FP_TECH: TK0; IP: GENERIC; ROOM: NONE; OriginalSymbolOrigin: (-25,50); XY: (4775,50); VER: 2; SUB_ROOM: CODEC_DECOUPLING; ROT: 0; PHYS_PAGE: 110; LOCATION: C21104; DRAWING: @RVP1_ADL_SB_ADP_S_DDR5_SODIMM_2DPC_LIB.H55_DG2_2DPC(SCH_1):PAGE481; CDS_LIB: c_discrete; VARIANT: ?; PCB Footprint: CTK0_SM0402_1050X550_MA; CDS_PART_NAME: C_CAP_0402-H35207-001,X5R,10UF,10V,20%,TK0,GENERIC; CDS_LOCATION: C21104
C21105 = CAP: CDS_PHYS_PART_NAME: CAP_0201-J49096-001,C0G,18PF,25V,5%,LPDB,GENERIC; OriginalSymbolOrigin: (-50,25); XY: (-575,250); VER: 1; SUB_ROOM: CODEC_DECOUPLING; ROT: 0; PHYS_PAGE: 110; LOCATION: C21105; DRAWING: @RVP1_ADL_SB_ADP_S_DDR5_SODIMM_2DPC_LIB.H55_DG2_2DPC(SCH_1):PAGE481; CDS_LIB: discrete; PCB Footprint: SMC0201IA; CHIPS_PART_NAME: CAP; CDS_PART_NAME: CAP_0201-J49096-001,C0G,18PF,25V,5%,LPDB,GENERIC; CDS_LOCATION: C21105
C21146 = C_CAP: CDS_PHYS_PART_NAME: C_CAP_0201-H66299-001,C0G,22PF,25V,5%,TK0,GENERIC; CDS_LMAN_SYM_OUTLINE: -50,50,50,-50; FP_TECH: TK0; IP: GENERIC; ROOM: NONE; OriginalSymbolOrigin: (-50,25); XY: (-850,-1450); VER: 1; SUB_ROOM: DECOUPLING; ROT: 0; PHYS_PAGE: 110; LOCATION: C21146; DRAWING: @RVP1_ADL_SB_ADP_S_DDR5_SODIMM_2DPC_LIB.H55_DG2_2DPC(SCH_1):PAGE481; CDS_LIB: c_discrete; VARIANT: ?; PCB Footprint: CTK0_SM0201_630X330_MA; CHIPS_PART_NAME: C_CAP; CDS_PART_NAME: C_CAP_0201-H66299-001,C0G,22PF,25V,5%,TK0,GENERIC; CDS_LOCATION: C21146
C21147 = C_CAP: CDS_PHYS_PART_NAME: C_CAP_0201-H66299-001,C0G,22PF,25V,5%,TK0,GENERIC; CDS_LMAN_SYM_OUTLINE: -50,50,50,-50; FP_TECH: TK0; IP: GENERIC; ROOM: NONE; OriginalSymbolOrigin: (-50,25); XY: (-575,-1425); VER: 1; SUB_ROOM: DECOUPLING; ROT: 2; PHYS_PAGE: 110; LOCATION: C21147; DRAWING: @RVP1_ADL_SB_ADP_S_DDR5_SODIMM_2DPC_LIB.H55_DG2_2DPC(SCH_1):PAGE481; CDS_LIB: c_discrete; VARIANT: ?; PCB Footprint: CTK0_SM0201_630X330_MA; CHIPS_PART_NAME: C_CAP; CDS_PART_NAME: C_CAP_0201-H66299-001,C0G,22PF,25V,5%,TK0,GENERIC; CDS_LOCATION: C21147
C21150 = C_CAP: CDS_PHYS_PART_NAME: C_CAP_0201-H66299-001,C0G,22PF,25V,5%,TK0,GENERIC; CDS_LMAN_SYM_OUTLINE: -50,50,50,-50; FP_TECH: TK0; IP: GENERIC; ROOM: NONE; OriginalSymbolOrigin: (-50,25); XY: (300,-1400); VER: 1; SUB_ROOM: DECOUPLING; ROT: 0; PHYS_PAGE: 110; LOCATION: C21150; DRAWING: @RVP1_ADL_SB_ADP_S_DDR5_SODIMM_2DPC_LIB.H55_DG2_2DPC(SCH_1):PAGE481; CDS_LIB: c_discrete; VARIANT: ?; PCB Footprint: CTK0_SM0201_630X330_MA; CHIPS_PART_NAME: C_CAP; CDS_PART_NAME: C_CAP_0201-H66299-001,C0G,22PF,25V,5%,TK0,GENERIC; CDS_LOCATION: C21150
C21151 = C_CAP: CDS_PHYS_PART_NAME: C_CAP_0201-H66299-001,C0G,22PF,25V,5%,TK0,GENERIC; CDS_LMAN_SYM_OUTLINE: -50,50,50,-50; FP_TECH: TK0; IP: GENERIC; ROOM: NONE; OriginalSymbolOrigin: (-50,25); XY: (700,-1400); VER: 1; SUB_ROOM: DECOUPLING; ROT: 2; PHYS_PAGE: 110; LOCATION: C21151; DRAWING: @RVP1_ADL_SB_ADP_S_DDR5_SODIMM_2DPC_LIB.H55_DG2_2DPC(SCH_1):PAGE481; CDS_LIB: c_discrete; VARIANT: ?; PCB Footprint: CTK0_SM0201_630X330_MA; CHIPS_PART_NAME: C_CAP; CDS_PART_NAME: C_CAP_0201-H66299-001,C0G,22PF,25V,5%,TK0,GENERIC; CDS_LOCATION: C21151
EU21014 = C_ALC711: CDS_PHYS_PART_NAME: C_ALC711_LCC-M10040-001,IC,ALC711-VD,TK1,GENERIC; CDS_LMAN_SYM_OUTLINE: -650,1000,600,-950; FP_TECH: TK1; IP: GENERIC; PACK_TYPE: LCC; ROOM: NONE; OriginalSymbolOrigin: (-675,1000); XY: (1925,750); VER: 1; ROT: 2; PHYS_PAGE: 110; LOCATION: EU21014; DRAWING: @RVP1_ADL_SB_ADP_S_DDR5_SODIMM_2DPC_LIB.H55_DG2_2DPC(SCH_1):PAGE481; CDS_LIB: local; VARIANT: ?; PCB Footprint: CTK1_LCC48_S6000_400_DFS4400_MA; SEC_TYPE: LCC; CHIPS_PART_NAME: C_ALC711; CDS_PART_NAME: C_ALC711_LCC-M10040-001,IC,ALC711-VD,TK1,GENERIC; CDS_LOCATION: EU21014
R11001 = RES: CDS_PHYS_PART_NAME: RES_0201-C48657-004,EMPTY,10K,1%,1/20W,LPDB,GENERIC; WATTAGE: 1/20W; OriginalSymbolOrigin: (-25,75); XY: (4600,-1325); VER: 2; SUB_ROOM: PUPD; ROT: 0; PHYS_PAGE: 110; LOCATION: R11001; IP: GENERIC; FP_TECH: LPDB; DRAWING: @RVP1_ADL_SB_ADP_S_DDR5_SODIMM_2DPC_LIB.H55_DG2_2DPC(SCH_1):PAGE481; CDS_LIB: discrete; PCB Footprint: SMR0201IA; CHIPS_PART_NAME: RES; CDS_PART_NAME: RES_0201-C48657-004,EMPTY,10K,1%,1/20W,LPDB,GENERIC; CDS_LOCATION: R11001
R11002 = RES: CDS_PHYS_PART_NAME: RES_0201-C48657-004,EMPTY,10K,1%,1/20W,LPDB,GENERIC; WATTAGE: 1/20W; OriginalSymbolOrigin: (-25,75); XY: (5400,-1350); VER: 2; SUB_ROOM: PUPD; ROT: 0; PHYS_PAGE: 110; LOCATION: R11002; IP: GENERIC; FP_TECH: LPDB; DRAWING: @RVP1_ADL_SB_ADP_S_DDR5_SODIMM_2DPC_LIB.H55_DG2_2DPC(SCH_1):PAGE481; CDS_LIB: discrete; PCB Footprint: SMR0201IA; CHIPS_PART_NAME: RES; CDS_PART_NAME: RES_0201-C48657-004,EMPTY,10K,1%,1/20W,LPDB,GENERIC; CDS_LOCATION: R11002
R21013 = RES#1: CHIPS_PART_NAME: RES; CDS_PHYS_PART_NAME: RES_0201-C48657-030,EMPTY,100K,1%,1/20W,LPDB,GENERIC; TOLERANCE: 1%; WATTAGE: 1/20W; OriginalSymbolOrigin: (-75,25); XY: (-1750,600); VER: 1; SUB_ROOM: CODEC_PUPD; ROT: 0; PHYS_PAGE: 110; LOCATION: R21013; IP: GENERIC; FP_TECH: LPDB; DRAWING: @RVP1_ADL_SB_ADP_S_DDR5_SODIMM_2DPC_LIB.H55_DG2_2DPC(SCH_1):PAGE481; CDS_LIB: discrete; PCB Footprint: SMR0201MC; SEC_TYPE: 0201; CDS_PART_NAME: RES_0201-C48657-030,EMPTY,100K,1%,1/20W,LPDB,GENERIC; CDS_LOCATION: R21013
R21042 = RES: CDS_PHYS_PART_NAME: RES_0201-C48657-004,EMPTY,10K,1%,1/20W,LPDB,GENERIC; WATTAGE: 1/20W; OriginalSymbolOrigin: (-25,75); XY: (2275,-1350); VER: 2; SUB_ROOM: PUPD; ROT: 0; PHYS_PAGE: 110; LOCATION: R21042; IP: GENERIC; FP_TECH: LPDB; DRAWING: @RVP1_ADL_SB_ADP_S_DDR5_SODIMM_2DPC_LIB.H55_DG2_2DPC(SCH_1):PAGE481; CDS_LIB: discrete; PCB Footprint: SMR0201IA; SEC_TYPE: 0201; CHIPS_PART_NAME: RES; CDS_PART_NAME: RES_0201-C48657-004,EMPTY,10K,1%,1/20W,LPDB,GENERIC; CDS_LOCATION: R21042
R21043 = RES: CDS_PHYS_PART_NAME: RES_0201-C48657-004,EMPTY,10K,1%,1/20W,LPDB,GENERIC; WATTAGE: 1/20W; OriginalSymbolOrigin: (-25,75); XY: (2725,-1350); VER: 2; SUB_ROOM: PUPD; ROT: 0; PHYS_PAGE: 110; LOCATION: R21043; IP: GENERIC; FP_TECH: LPDB; DRAWING: @RVP1_ADL_SB_ADP_S_DDR5_SODIMM_2DPC_LIB.H55_DG2_2DPC(SCH_1):PAGE481; CDS_LIB: discrete; PCB Footprint: SMR0201IA; SEC_TYPE: 0201; CHIPS_PART_NAME: RES; CDS_PART_NAME: RES_0201-C48657-004,EMPTY,10K,1%,1/20W,LPDB,GENERIC; CDS_LOCATION: R21043
R21046 = RES: CDS_PHYS_PART_NAME: RES_0201-C48657-004,CHIP,10K,1%,1/20W,LPDB,GENERIC; WATTAGE: 1/20W; OriginalSymbolOrigin: (-25,75); XY: (3675,-1275); VER: 2; SUB_ROOM: PUPD; ROT: 0; PHYS_PAGE: 110; LOCATION: R21046; IP: GENERIC; FP_TECH: LPDB; DRAWING: @RVP1_ADL_SB_ADP_S_DDR5_SODIMM_2DPC_LIB.H55_DG2_2DPC(SCH_1):PAGE481; CDS_LIB: discrete; PCB Footprint: SMR0201IA; CHIPS_PART_NAME: RES; CDS_PART_NAME: RES_0201-C48657-004,CHIP,10K,1%,1/20W,LPDB,GENERIC; CDS_LOCATION: R21046
R21093 = RES: CDS_PHYS_PART_NAME: RES_0201-C48657-004,CHIP,10K,1%,1/20W,LPDB,GENERIC; TOLERANCE: 1%; OriginalSymbolOrigin: (-25,75); XY: (-975,275); VER: 2; SUB_ROOM: CODEC_PUPD; ROT: 0; PHYS_PAGE: 110; LOCATION: R21093; IP: GENERIC; FP_TECH: LPDB; DRAWING: @RVP1_ADL_SB_ADP_S_DDR5_SODIMM_2DPC_LIB.H55_DG2_2DPC(SCH_1):PAGE481; CDS_LIB: discrete; PCB Footprint: SMR0201IA; CHIPS_PART_NAME: RES; CDS_PART_NAME: RES_0201-C48657-004,CHIP,10K,1%,1/20W,LPDB,GENERIC; CDS_LOCATION: R21093
R21097 = RES#1: CHIPS_PART_NAME: RES; CDS_PHYS_PART_NAME: RES_0201-C48657-030,CHIP,100K,1%,1/20W,LPDB,GENERIC; OriginalSymbolOrigin: (-75,25); XY: (3875,-525); VER: 1; SUB_ROOM: CODEC_PUPD; ROT: 0; PHYS_PAGE: 110; LOCATION: R21097; IP: GENERIC; FP_TECH: LPDB; DRAWING: @RVP1_ADL_SB_ADP_S_DDR5_SODIMM_2DPC_LIB.H55_DG2_2DPC(SCH_1):PAGE481; CDS_LIB: discrete; PCB Footprint: SMR0201MC; CDS_PART_NAME: RES_0201-C48657-030,CHIP,100K,1%,1/20W,LPDB,GENERIC; CDS_LOCATION: R21097
R21100 = RES: CDS_PHYS_PART_NAME: RES_0201-C48657-004,CHIP,10K,1%,1/20W,LPDB,GENERIC; TOLERANCE: 1%; WATTAGE: 1/20W; OriginalSymbolOrigin: (-25,75); XY: (175,200); VER: 2; SUB_ROOM: CODEC_PUPD; ROT: 0; PHYS_PAGE: 110; LOCATION: R21100; IP: GENERIC; FP_TECH: LPDB; DRAWING: @RVP1_ADL_SB_ADP_S_DDR5_SODIMM_2DPC_LIB.H55_DG2_2DPC(SCH_1):PAGE481; CDS_LIB: discrete; PCB Footprint: SMR0201IA; CHIPS_PART_NAME: RES; CDS_PART_NAME: RES_0201-C48657-004,CHIP,10K,1%,1/20W,LPDB,GENERIC; CDS_LOCATION: R21100
R21102 = RES: CDS_PHYS_PART_NAME: RES_0201-C48657-004,CHIP,10K,1%,1/20W,LPDB,GENERIC; TOLERANCE: 1%; WATTAGE: 1/20W; OriginalSymbolOrigin: (-25,75); XY: (-200,275); VER: 2; SUB_ROOM: CODEC_PUPD; ROT: 0; PHYS_PAGE: 110; LOCATION: R21102; IP: GENERIC; FP_TECH: LPDB; DRAWING: @RVP1_ADL_SB_ADP_S_DDR5_SODIMM_2DPC_LIB.H55_DG2_2DPC(SCH_1):PAGE481; CDS_LIB: discrete; PCB Footprint: SMR0201IA; CHIPS_PART_NAME: RES; CDS_PART_NAME: RES_0201-C48657-004,CHIP,10K,1%,1/20W,LPDB,GENERIC; CDS_LOCATION: R21102
R21131 = RES#1: CHIPS_PART_NAME: RES; CDS_PHYS_PART_NAME: RES_0201-C48657-027,EMPTY,0,1%,1/20W,LPDB,GENERIC; OriginalSymbolOrigin: (-75,25); XY: (3400,600); VER: 1; SUB_ROOM: DEBUG; PHYS_PAGE: 110; LOCATION: R21131; IP: GENERIC; FP_TECH: LPDB; DRAWING: @RVP1_ADL_SB_ADP_S_DDR5_SODIMM_2DPC_LIB.H55_DG2_2DPC(SCH_1):PAGE481; CDS_LIB: discrete; PCB Footprint: SMR0201IA; SEC_TYPE: 0201; ROT: 0; CDS_PART_NAME: RES_0201-C48657-027,EMPTY,0,1%,1/20W,LPDB,GENERIC; CDS_LOCATION: R21131
R21132 = RES#1: CHIPS_PART_NAME: RES; CDS_PHYS_PART_NAME: RES_0201-C48657-027,CHIP,0,1%,1/20W,LPDB,GENERIC; OriginalSymbolOrigin: (-75,25); XY: (3400,700); VER: 1; SUB_ROOM: DEBUG; PHYS_PAGE: 110; LOCATION: R21132; IP: GENERIC; FP_TECH: LPDB; DRAWING: @RVP1_ADL_SB_ADP_S_DDR5_SODIMM_2DPC_LIB.H55_DG2_2DPC(SCH_1):PAGE481; CDS_LIB: discrete; PCB Footprint: SMR0201IA; SEC_TYPE: 0201; ROT: 0; CDS_PART_NAME: RES_0201-C48657-027,CHIP,0,1%,1/20W,LPDB,GENERIC; CDS_LOCATION: R21132
R21148 = RES#1: CHIPS_PART_NAME: RES; CDS_PHYS_PART_NAME: RES_0201-C48657-027,CHIP,0,1%,1/20W,LPDB,GENERIC; TOLERANCE: 1%; WATTAGE: 1/20W; OriginalSymbolOrigin: (-75,25); XY: (-175,-1050); VER: 1; SUB_ROOM: TERMINATION; PHYS_PAGE: 110; LOCATION: R21148; DRAWING: @RVP1_ADL_SB_ADP_S_DDR5_SODIMM_2DPC_LIB.H55_DG2_2DPC(SCH_1):PAGE481; CDS_LIB: discrete; PCB Footprint: SMR0201IA; ROT: 0; CDS_PART_NAME: RES_0201-C48657-027,CHIP,0,1%,1/20W,LPDB,GENERIC; CDS_LOCATION: R21148
R21149 = RES#1: CHIPS_PART_NAME: RES; CDS_PHYS_PART_NAME: RES_0201-C48657-027,CHIP,0,1%,1/20W,LPDB,GENERIC; TOLERANCE: 1%; WATTAGE: 1/20W; OriginalSymbolOrigin: (-75,25); XY: (-175,-1225); VER: 1; SUB_ROOM: TERMINATION; PHYS_PAGE: 110; LOCATION: R21149; DRAWING: @RVP1_ADL_SB_ADP_S_DDR5_SODIMM_2DPC_LIB.H55_DG2_2DPC(SCH_1):PAGE481; CDS_LIB: discrete; PCB Footprint: SMR0201IA; ROT: 0; CDS_PART_NAME: RES_0201-C48657-027,CHIP,0,1%,1/20W,LPDB,GENERIC; CDS_LOCATION: R21149
TP21127 = TP#2: PART_NUMBER: NA_TPS16; CDS_PHYS_PART_NAME: TP_SM-NA_TPS16,EMPTY,TPS16,LPDB,GENERIC; CDS_LMAN_SYM_OUTLINE: -150,100,100,-100; PACK_TYPE: SM; OriginalSymbolOrigin: (-75,50); XY: (-1225,550); VER: 1; ROT: 2; PHYS_PAGE: 110; LOCATION: TP21127; IP: GENERIC; FP_TECH: LPDB; DRAWING: @RVP1_ADL_SB_ADP_S_DDR5_SODIMM_2DPC_LIB.H55_DG2_2DPC(SCH_1):PAGE481; CDS_LIB: board_artifacts; PCB Footprint: TPS16; CHIPS_PART_NAME: TP; CDS_PART_NAME: TP_SM-NA_TPS16,EMPTY,TPS16,LPDB,GENERIC; CDS_LOCATION: TP21127
TP21128 = TP#2: PART_NUMBER: NA_TPS16; CDS_PHYS_PART_NAME: TP_SM-NA_TPS16,EMPTY,TPS16,LPDB,GENERIC; CDS_LMAN_SYM_OUTLINE: -150,100,100,-100; PACK_TYPE: SM; OriginalSymbolOrigin: (-75,50); XY: (700,325); VER: 1; ROT: 2; PHYS_PAGE: 110; LOCATION: TP21128; IP: GENERIC; FP_TECH: LPDB; DRAWING: @RVP1_ADL_SB_ADP_S_DDR5_SODIMM_2DPC_LIB.H55_DG2_2DPC(SCH_1):PAGE481; CDS_LIB: board_artifacts; PCB Footprint: TPS16; CHIPS_PART_NAME: TP; CDS_PART_NAME: TP_SM-NA_TPS16,EMPTY,TPS16,LPDB,GENERIC; CDS_LOCATION: TP21128
TP21129 = TP#2: PART_NUMBER: NA_TPS16; CDS_PHYS_PART_NAME: TP_SM-NA_TPS16,EMPTY,TPS16,LPDB,GENERIC; CDS_LMAN_SYM_OUTLINE: -150,100,100,-100; PACK_TYPE: SM; OriginalSymbolOrigin: (-75,50); XY: (700,200); VER: 1; ROT: 2; PHYS_PAGE: 110; LOCATION: TP21129; IP: GENERIC; FP_TECH: LPDB; DRAWING: @RVP1_ADL_SB_ADP_S_DDR5_SODIMM_2DPC_LIB.H55_DG2_2DPC(SCH_1):PAGE481; CDS_LIB: board_artifacts; PCB Footprint: TPS16; CHIPS_PART_NAME: TP; CDS_PART_NAME: TP_SM-NA_TPS16,EMPTY,TPS16,LPDB,GENERIC; CDS_LOCATION: TP21129